# Altium schematic sheet led_system.SchDoc
size A4
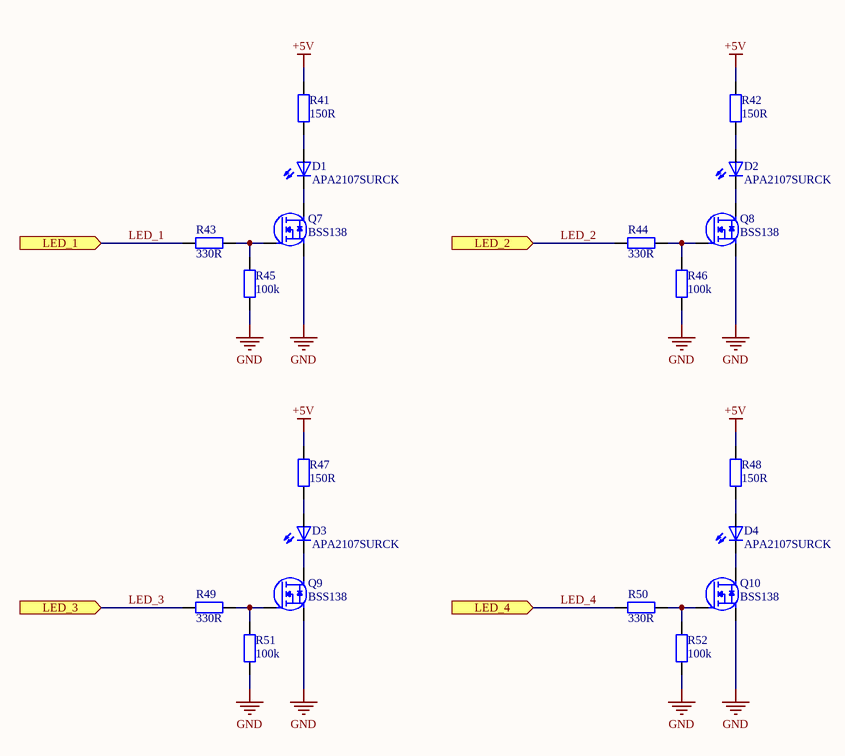
[diagram p0: led_system.SchDoc]

## Parts
D1  APA2107SURCK  [LED_0805_RA_INV]
D2  APA2107SURCK  [LED_0805_RA]
D3  APA2107SURCK  [LED_0805_RA_INV]
D4  APA2107SURCK  [LED_0805_RA]
Q7  BSS138  [SOT23]
Q8  BSS138  [SOT23]
Q9  BSS138  [SOT23]
Q10  BSS138  [SOT23]
R41  150R  [R0603_IPC_MD]
R42  150R  [R0603_IPC_MD]
R43  330R  [R0603_IPC_MD]
R44  330R  [R0603_IPC_MD]
R45  100k  [R0603_IPC_MD]
R46  100k  [R0603_IPC_MD]
R47  150R  [R0603_IPC_MD]
R48  150R  [R0603_IPC_MD]
R49  330R  [R0603_IPC_MD]
R50  330R  [R0603_IPC_MD]
R51  100k  [R0603_IPC_MD]
R52  100k  [R0603_IPC_MD]

## Ports
LED_1 (in), LED_2 (in), LED_3 (in), LED_4 (in)

## Nets
+5V: R41.2 R42.2 R47.2 R48.2
GND: Q7.2(S) Q8.2(S) Q9.2(S) Q10.2(S) R45.2 R46.2 R51.2 R52.2
LED_1: R43.2 ; port LED_1
LED_2: R44.2 ; port LED_2
LED_3: R49.2 ; port LED_3
LED_4: R50.2 ; port LED_4
NetD1_1: D1.1(C) Q7.3(D)
NetD1_2: D1.2(A) R41.1
NetD2_1: D2.1(C) Q8.3(D)
NetD2_2: D2.2(A) R42.1
NetD3_1: D3.1(C) Q9.3(D)
NetD3_2: D3.2(A) R47.1
NetD4_1: D4.1(C) Q10.3(D)
NetD4_2: D4.2(A) R48.1
NetQ7_1: Q7.1(G) R43.1 R45.1
NetQ8_1: Q8.1(G) R44.1 R46.1
NetQ9_1: Q9.1(G) R49.1 R51.1
NetQ10_1: Q10.1(G) R50.1 R52.1

## Library data of the parts
D1-D4 = APA2107SURCK: LED RED CLEAR SMD R/A; Manufacturer: Kingbright; Manufacturer Part Number: APA2107SURCK; Color: Red; Supplier 1: Digi-Key; Supplier Part Number 1: 754-2099-1-ND
Q7-Q10 = BSS138: N-Channel Logic Level Enhancement Mode Field Effect Transistor; Manufacturer: Diodes Incorporated; Manufacturer Part Number: BSS138; Supplier 1: Digi-Key; Supplier Part Number 1: BSS138-FDICT-ND
R41 R42 R47 R48 = RMCF0603FT150R: RES 150 OHM 1% 1/10W 0603; Manufacturer: Stackpole Electronics Inc; Value: 150R; Tolarance: 1%; Manufacturer Part Number: RMCF0603FT150R; Supplier 1: Digi-Key; Supplier Part Number 1: RMCF0603FT150RCT-ND
R43 R44 R49 R50 = CR0603-JW-331ELF: RES SMD 330 OHM 5% 1/10W 0603; Manufacturer: Bourns Inc.; Value: 330R; Tolarance: 5%; Manufacturer Part Number: CR0603-JW-331ELF; Supplier 1: Digi-Key; Supplier Part Number 1: CR0603-JW-331ELFCT-ND
R45 R46 R51 R52 = RMCF0603FT100K: RES 100K OHM 1% 1/10W 0603; Manufacturer: Bourns Inc.; Value: 100k; Tolarance: 1%; Manufacturer Part Number: RMCF0603FT100K; Supplier 1: Digi-Key; Supplier Part Number 1: RMCF0603FT100KCT-ND